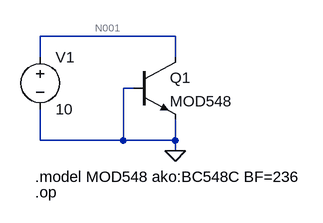
[diagram p0: schematic Draft5.asc]
Draft5.asc, the LTspice schematic file:
Version 4
SHEET 1 880 680
WIRE 256 64 48 64
WIRE 48 96 48 64
WIRE 256 96 256 64
WIRE 192 144 176 144
WIRE 48 224 48 176
WIRE 176 224 176 144
WIRE 176 224 48 224
WIRE 256 224 256 192
WIRE 256 224 176 224
WIRE 256 240 256 224
FLAG 256 240 0
DATAFLAG 176 64 "Ic(Q1)"
SYMBOL npn 192 96 R0
SYMATTR InstName Q1
SYMATTR Value MOD548
SYMBOL voltage 48 80 R0
WINDOW 123 0 0 Left 0
WINDOW 39 0 0 Left 0
SYMATTR InstName V1
SYMATTR Value 10
TEXT 40 280 Left 2 !.model MOD548 ako:BC548C BF=236
TEXT 40 304 Left 2 !.op

The netlist it stands for:
* Draft5.asc
Q1 N001 0 0 0 MOD548
V1 N001 0 10
.model NPN NPN
.model PNP PNP
.lib standard.bjt
.model MOD548 ako:BC548C BF=236
.op
.backanno
.end

* Results of the author's LTspice run, read from the files saved beside the schematic
* Operating Point:
*   V(n001) = 10 V
*   Ic(Q1) = 10.13 pA
*   Ib(Q1) = -10.11 pA
*   Ie(Q1) = -21.63 fA
*   I(V1) = -10.13 pA
* From the log:
*   Semiconductor Device Operating Points:
*                           --- Bipolar Transistors ---
*   Name:       q1
*   Model:    mod548
*   Ib:      -1.01e-11
*   Ic:       1.01e-11
*   Vbe:      0.00e+00
*   Vbc:     -1.00e+01
*   Vce:      1.00e+01
*   BetaDC:  -1.00e+00
*   Gm:       8.41e-13
*   Rpi:      9.60e+11
*   Rx:       2.65e+01
*   Ro:       4.70e+15
*   Cbe:      1.33e-11
*   Cbc:      1.74e-12
*   Cjs:      0.00e+00
*   BetaAC:   8.07e-01
*   Cbx:      0.00e+00
*   Ft:       6.50e-03